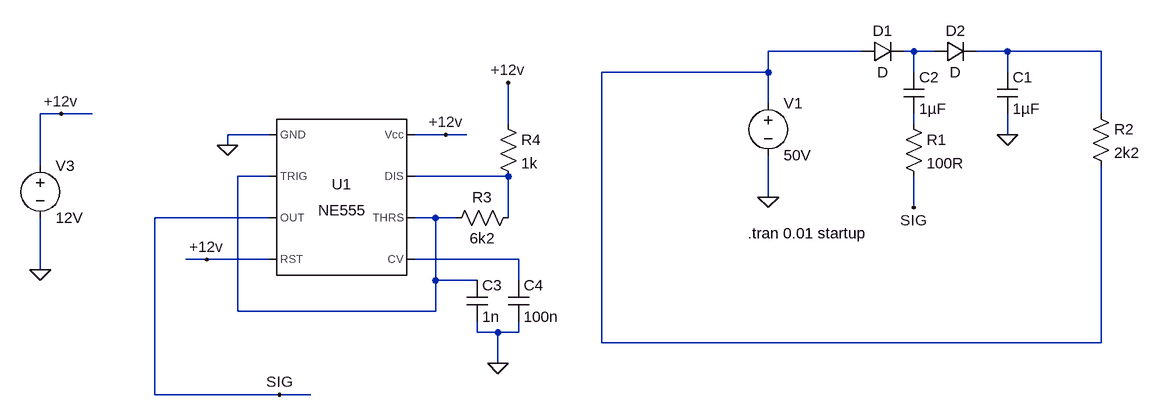
[diagram p0: schematic ChargePump.asc]
ChargePump.asc, the LTspice schematic file:
Version 4
SHEET 1 880 680
WIRE 112 -208 -32 -208
WIRE 192 -208 176 -208
WIRE 224 -208 192 -208
WIRE 336 -208 288 -208
WIRE 480 -208 336 -208
WIRE -32 -176 -32 -208
WIRE -32 -176 -288 -176
WIRE 192 -176 192 -208
WIRE 336 -176 336 -208
WIRE -32 -128 -32 -176
WIRE -1120 -112 -1152 -112
WIRE -1072 -112 -1120 -112
WIRE 480 -112 480 -208
WIRE -432 -96 -432 -160
WIRE 192 -96 192 -112
WIRE -800 -80 -864 -80
WIRE -528 -80 -576 -80
WIRE -496 -80 -528 -80
WIRE 336 -80 336 -112
WIRE -864 -64 -864 -80
WIRE -1152 -32 -1152 -112
WIRE -800 -16 -848 -16
WIRE -432 -16 -576 -16
WIRE -32 16 -32 -48
WIRE 192 32 192 -16
WIRE -800 48 -976 48
WIRE -544 48 -576 48
WIRE -512 48 -544 48
WIRE -432 48 -432 -16
WIRE -896 112 -928 112
WIRE -800 112 -896 112
WIRE -416 112 -576 112
WIRE -1152 128 -1152 48
WIRE -544 144 -544 48
WIRE -480 144 -544 144
WIRE -416 144 -416 112
WIRE -848 192 -848 -16
WIRE -544 192 -544 144
WIRE -544 192 -848 192
WIRE -480 224 -480 208
WIRE -448 224 -480 224
WIRE -416 224 -416 208
WIRE -416 224 -448 224
WIRE -288 240 -288 -176
WIRE 480 240 480 -32
WIRE 480 240 -288 240
WIRE -448 272 -448 224
WIRE -976 320 -976 48
WIRE -784 320 -976 320
WIRE -736 320 -784 320
FLAG -32 16 0
FLAG 336 -80 0
FLAG -1152 128 0
FLAG -1120 -112 +12v
FLAG -528 -80 +12v
FLAG -864 -64 0
FLAG -896 112 +12v
FLAG -432 -160 +12v
FLAG -448 272 0
FLAG -784 320 SIG
FLAG 192 32 SIG
SYMBOL voltage -32 -144 R0
WINDOW 123 0 0 Left 0
WINDOW 39 0 0 Left 0
SYMATTR InstName V1
SYMATTR Value 50V
SYMBOL diode 112 -192 R270
WINDOW 0 32 32 VTop 2
WINDOW 3 0 32 VBottom 2
SYMATTR InstName D1
SYMBOL diode 224 -192 R270
WINDOW 0 32 32 VTop 2
WINDOW 3 0 32 VBottom 2
SYMATTR InstName D2
SYMBOL cap 320 -176 R0
SYMATTR InstName C1
SYMATTR Value 1µF
SYMBOL cap 176 -176 R0
SYMATTR InstName C2
SYMATTR Value 1µF
SYMBOL res 176 -112 R0
SYMATTR InstName R1
SYMATTR Value 100R
SYMBOL res 464 -128 R0
SYMATTR InstName R2
SYMATTR Value 2k2
SYMBOL Misc\\NE555 -688 16 R0
SYMATTR InstName U1
SYMBOL voltage -1152 -48 R0
WINDOW 123 0 0 Left 0
WINDOW 39 0 0 Left 0
SYMATTR InstName V3
SYMATTR Value 12V
SYMBOL res -416 32 R90
WINDOW 0 0 56 VBottom 2
WINDOW 3 32 56 VTop 2
SYMATTR InstName R3
SYMATTR Value 6k2
SYMBOL res -448 -112 R0
SYMATTR InstName R4
SYMATTR Value 1k
SYMBOL cap -496 144 R0
SYMATTR InstName C3
SYMATTR Value 1n
SYMBOL cap -432 144 R0
SYMATTR InstName C4
SYMATTR Value 100n
TEXT -64 72 Left 2 !.tran 0.01 startup

The netlist it stands for:
* ChargePump.asc
V1 N001 0 50V
D1 N001 N002 D
D2 N002 N003 D
C1 N003 0 1µF
C2 N002 N004 1µF
R1 N004 SIG 100R
R2 N003 N001 2k2
XU1 0 N005 SIG +12v N007 N005 N006 +12v NE555  ; pins GND TRIG OUT RST CV THRS DIS Vcc
V3 +12v 0 12V
R3 N006 N005 6k2
R4 +12v N006 1k
C3 N005 0 1n
C4 N007 0 100n
.model D D
.lib standard.dio
.tran 0.01 startup
.lib NE555.sub
.backanno
.end